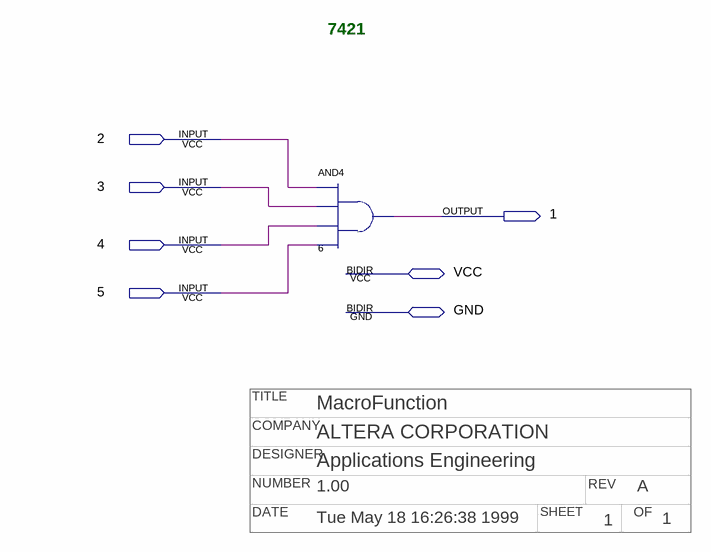
[diagram p0: schematic sheet]
// Quartus schematic np7421.bdf as structural Verilog: 1 symbols, 7 pins
// Title block: TITLE: MacroFunction; COMPANY: ALTERA CORPORATION; DESIGNER: Applications Engineering; NUMBER: 1.00; REV: A; DATE: Tue May 18 16:26:38 1999; SHEET: 1; OF: 1
module np7421 (
  input  \2 ,
  input  \3 ,
  input  \4 ,
  input  \5 ,
  inout  VCC,
  inout  GND,
  output \1 
);

  and u_6 (\1 , \2 , \3 , \4 , \5 );

  // Notes on the sheet:
  //   7421
endmodule
